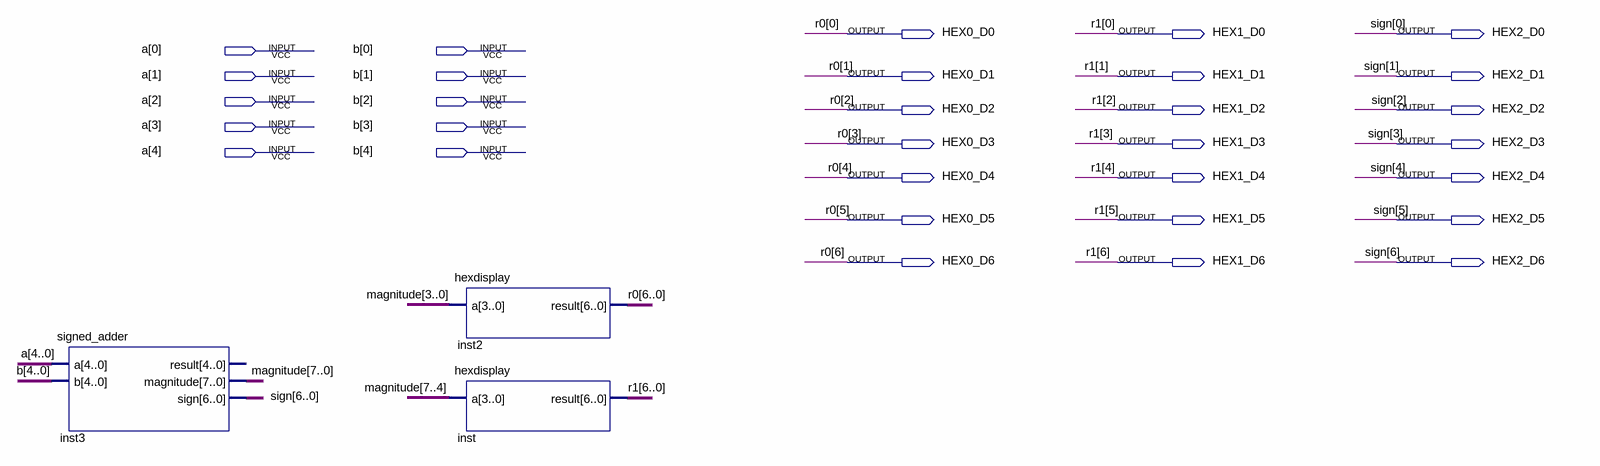
[diagram p0: schematic sheet]
// Quartus schematic signed_adder_extension.bdf as structural Verilog: 3 symbols, 31 pins
module signed_adder_extension (
  input  [4:0] a,
  input  [4:0] b,
  output HEX0_D0,
  output HEX1_D0,
  output HEX2_D0,
  output HEX0_D1,
  output HEX1_D1,
  output HEX2_D1,
  output HEX0_D2,
  output HEX1_D2,
  output HEX2_D2,
  output HEX0_D3,
  output HEX1_D3,
  output HEX2_D3,
  output HEX0_D4,
  output HEX1_D4,
  output HEX2_D4,
  output HEX0_D5,
  output HEX1_D5,
  output HEX2_D5,
  output HEX0_D6,
  output HEX1_D6,
  output HEX2_D6
);

  wire [7:0] magnitude;

  signed_adder inst3 (
    .a(a), .b(b), .magnitude(magnitude),
    .sign({HEX2_D6, HEX2_D5, HEX2_D4, HEX2_D3, HEX2_D2, HEX2_D1, HEX2_D0}));  // open: result
  hexdisplay inst2 (.a(magnitude[3:0]), .result({HEX0_D6, HEX0_D5, HEX0_D4, HEX0_D3, HEX0_D2, HEX0_D1, HEX0_D0}));
  hexdisplay inst (.a(magnitude[7:4]), .result({HEX1_D6, HEX1_D5, HEX1_D4, HEX1_D3, HEX1_D2, HEX1_D1, HEX1_D0}));

  // Other names for the same wires on the sheet: r0[6:0] = {HEX0_D6, HEX0_D5, HEX0_D4, HEX0_D3, HEX0_D2, HEX0_D1, HEX0_D0};
  //   r1[6:0] = {HEX1_D6, HEX1_D5, HEX1_D4, HEX1_D3, HEX1_D2, HEX1_D1, HEX1_D0};
  //   sign[6:0] = {HEX2_D6, HEX2_D5, HEX2_D4, HEX2_D3, HEX2_D2, HEX2_D1, HEX2_D0}
endmodule
